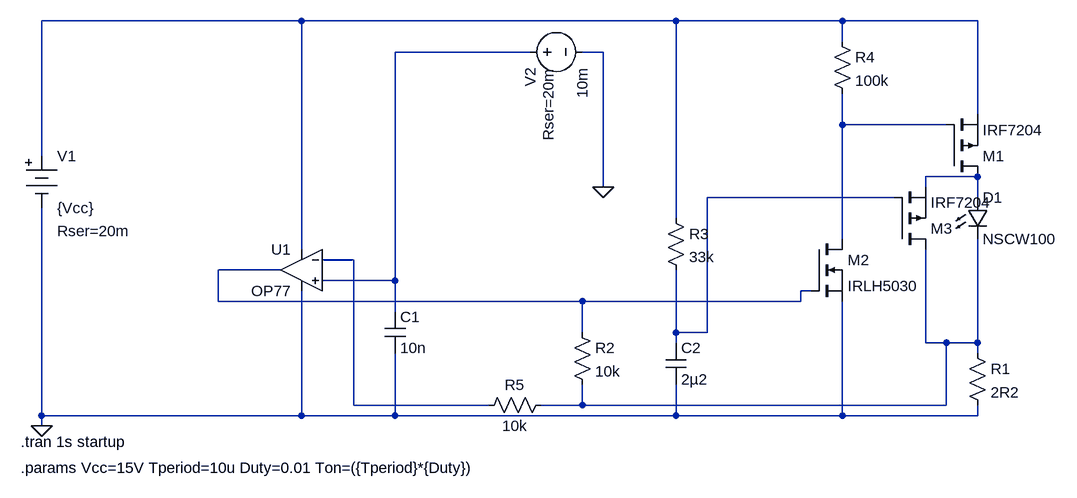
[diagram p0: schematic LOD_MCU_currernt_source.asc]
LOD_MCU_currernt_source.asc, the LTspice schematic file:
Version 4
SHEET 1 1296 680
WIRE 128 -304 -272 -304
WIRE 704 -304 128 -304
WIRE 960 -304 704 -304
WIRE 1168 -304 960 -304
WIRE 960 -272 960 -304
WIRE 480 -256 272 -256
WIRE 592 -256 560 -256
WIRE 1168 -160 1168 -304
WIRE 960 -144 960 -192
WIRE 1120 -144 960 -144
WIRE -272 -96 -272 -304
WIRE 1168 -64 1088 -64
WIRE 592 -48 592 -256
WIRE 1088 -48 1088 -64
WIRE 1040 -32 752 -32
WIRE 1168 -32 1168 -64
WIRE 704 0 704 -304
WIRE 960 32 960 -144
WIRE 128 48 128 -304
WIRE 208 64 160 64
WIRE 96 80 0 80
WIRE 272 96 272 -256
WIRE 272 96 160 96
WIRE 912 112 896 112
WIRE 0 128 0 80
WIRE 560 128 0 128
WIRE 896 128 896 112
WIRE 896 128 560 128
WIRE 272 144 272 96
WIRE 560 176 560 128
WIRE 704 176 704 80
WIRE 752 176 752 -32
WIRE 752 176 704 176
WIRE 704 192 704 176
WIRE 1088 192 1088 48
WIRE 1120 192 1088 192
WIRE 1168 192 1168 32
WIRE 1168 192 1120 192
WIRE 1168 208 1168 192
WIRE 208 288 208 64
WIRE 416 288 208 288
WIRE 560 288 560 256
WIRE 560 288 496 288
WIRE 1120 288 1120 192
WIRE 1120 288 560 288
WIRE -272 304 -272 -16
WIRE 128 304 128 112
WIRE 128 304 -272 304
WIRE 272 304 272 208
WIRE 272 304 128 304
WIRE 704 304 704 256
WIRE 704 304 272 304
WIRE 960 304 960 128
WIRE 960 304 704 304
WIRE 1168 304 1168 288
WIRE 1168 304 960 304
WIRE -272 320 -272 304
FLAG -272 320 0
FLAG 592 -48 0
SYMBOL Misc\\battery -272 -112 R0
WINDOW 123 0 0 Left 0
WINDOW 39 24 132 Left 2
SYMATTR SpiceLine Rser=20m
SYMATTR InstName V1
SYMATTR Value {Vcc}
SYMBOL LED 1152 -32 R0
SYMATTR InstName D1
SYMATTR Value NSCW100
SYMATTR Description Diode
SYMATTR Type diode
SYMBOL res 1152 192 R0
SYMATTR InstName R1
SYMATTR Value 2R2
SYMBOL res 944 -288 R0
SYMATTR InstName R4
SYMATTR Value 100k
SYMBOL pmos 1120 -64 M180
SYMATTR InstName M1
SYMATTR Value IRF7204
SYMBOL nmos 912 32 R0
SYMATTR InstName M2
SYMATTR Value IRLH5030
SYMBOL voltage 464 -256 M90
WINDOW 123 0 0 Left 0
WINDOW 39 24 44 Left 2
SYMATTR SpiceLine Rser=20m
SYMATTR InstName V2
SYMATTR Value 10m
SYMBOL cap 256 144 R0
SYMATTR InstName C1
SYMATTR Value 10n
SYMATTR SpiceLine Rser=200m
SYMBOL pmos 1040 48 M180
SYMATTR InstName M3
SYMATTR Value IRF7204
SYMBOL cap 688 192 R0
SYMATTR InstName C2
SYMATTR Value 2µ2
SYMATTR SpiceLine V=16 Irms=8.41 Rser=0.00416295 Lser=0
SYMBOL res 688 -16 R0
SYMATTR InstName R3
SYMATTR Value 33k
SYMBOL res 544 160 R0
SYMATTR InstName R2
SYMATTR Value 10k
SYMBOL res 512 272 R90
WINDOW 0 0 56 VBottom 2
WINDOW 3 32 56 VTop 2
SYMATTR InstName R5
SYMATTR Value 10k
SYMBOL Opamps\\OP77 128 16 M0
SYMATTR InstName U1
TEXT -304 344 Left 2 !.tran 1s startup
TEXT -304 384 Left 2 !.params Vcc=15V Tperiod=10u Duty=0.01 Ton=({Tperiod}*{Duty})

The netlist it stands for:
* LOD_MCU_currernt_source.asc
V1 N001 0 {Vcc} Rser=20m
D1 N004 N008 NSCW100
R1 N008 0 2R2
R4 N001 N003 100k
M1 N004 N003 N001 N001 IRF7204
M2 N003 N007 0 0 IRLH5030
V2 N002 0 10m Rser=20m
C1 N002 0 10n Rser=200m
M3 N008 N005 N004 N004 IRF7204
C2 N005 0 2µ2 V=16 Irms=8.41 Rser=0.00416295 Lser=0
R3 N001 N005 33k
R2 N007 N008 10k
R5 N008 N006 10k
XU1 N002 N006 N001 0 N007 OP77  ; pins In+ In- V+ V- OUT
.model D D
.lib standard.dio
.model NMOS NMOS
.model PMOS PMOS
.lib standard.mos
.tran 1s startup
.params Vcc=15V Tperiod=10u Duty=0.01 Ton=({Tperiod}*{Duty})
.lib ADI.lib
.backanno
.end